# Altium schematic sheet con-top-j4-1.SchDoc: Connector - J4(Top) 1
size Letter; CheckedBy: E. Chiu; CompanyName: Signal Laboratories, Inc.; DrawnBy: J. Brinton; Engineer: J. Brinton; Address1: 3479 Edison Way; Address2: Menlo Park CA 94025; Address3: +1 (877) 778-8435; Address4: siglabs.com; Revision: 1; SheetNumber: 25; SheetTotal: 40
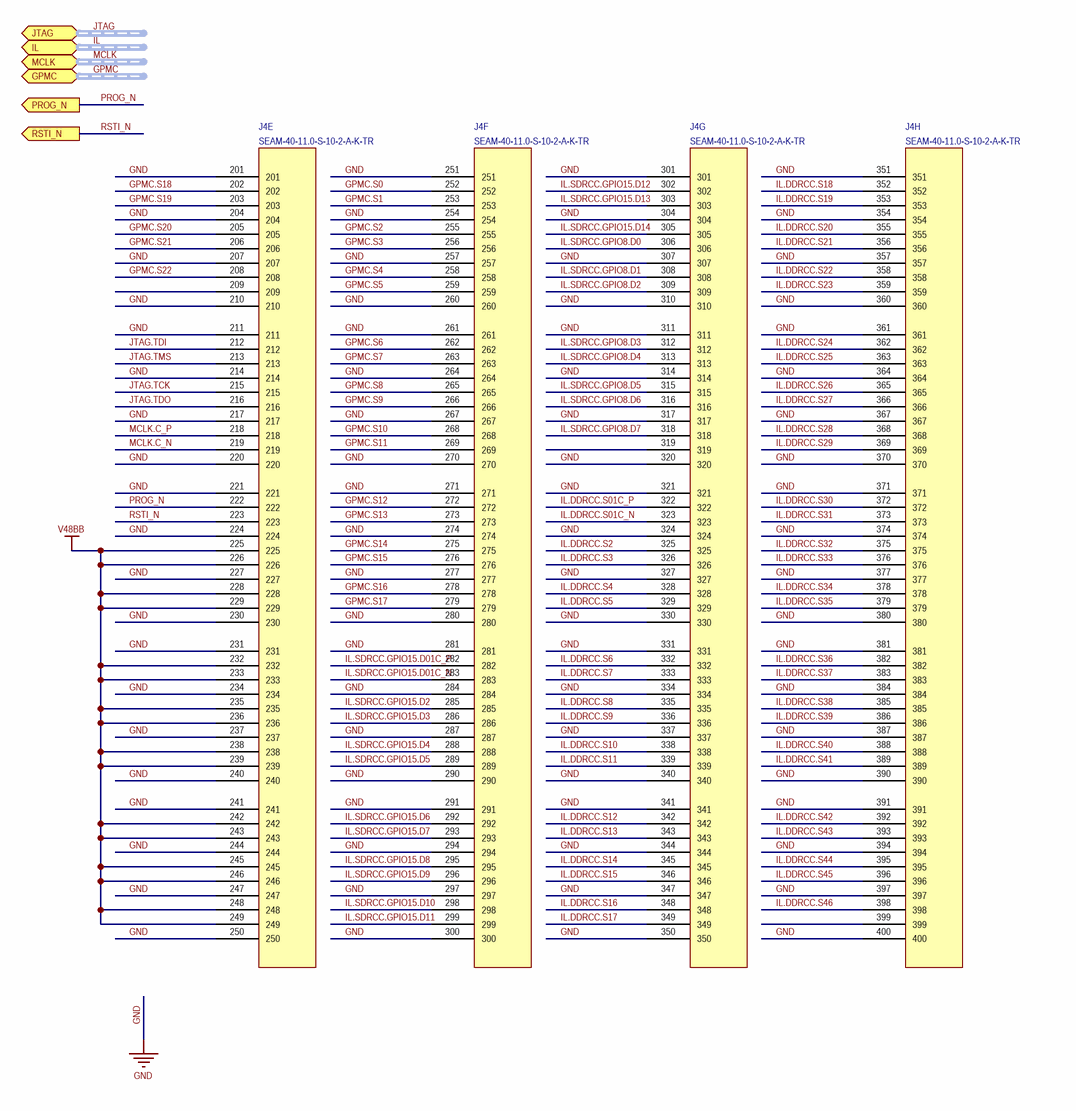
[diagram p0: con-top-j4-1.SchDoc]

## Parts
J4  SEAM-40-11.0-S-10-2-A-K-TR  [SEAM-40-11.0-S-10-2-A-K-TR]  (parts E,F,G,H of 8)

## Ports
GPMC (harness GPMC), IL (harness IL-1V5), JTAG (harness JTAG-1V5), MCLK (harness LVPECL33), PROG_N (out), RSTI_N (out)

## Nets
GND: J4.201 J4.204 J4.207 J4.210 J4.211 J4.214 J4.217 J4.220 J4.221 J4.224 J4.227 J4.230 J4.231 J4.234 J4.237 J4.240 J4.241 J4.244 J4.247 J4.250 J4.251 J4.254 J4.257 J4.260 J4.261 J4.264 J4.267 J4.270 J4.271 J4.274 J4.277 J4.280 J4.281 J4.284 J4.287 J4.290 J4.291 J4.294 J4.297 J4.300 J4.301 J4.304 J4.307 J4.310 J4.311 J4.314 J4.317 J4.320 J4.321 J4.324 J4.327 J4.330 J4.331 J4.334 J4.337 J4.340 J4.341 J4.344 J4.347 J4.350 J4.351 J4.354 J4.357 J4.360 J4.361 J4.364 J4.367 J4.370 J4.371 J4.374 J4.377 J4.380 J4.381 J4.384 J4.387 J4.390 J4.391 J4.394 J4.397 J4.400
V48BB: J4.225 J4.226 J4.228 J4.229 J4.232 J4.233 J4.235 J4.236 J4.238 J4.239 J4.242 J4.243 J4.245 J4.246 J4.248 J4.249
GPMC.S0: J4.252
GPMC.S1: J4.253
GPMC.S2: J4.255
GPMC.S3: J4.256
GPMC.S4: J4.258
GPMC.S5: J4.259
GPMC.S6: J4.262
GPMC.S7: J4.263
GPMC.S8: J4.265
GPMC.S9: J4.266
GPMC.S10: J4.268
GPMC.S11: J4.269
GPMC.S12: J4.272
GPMC.S13: J4.273
GPMC.S14: J4.275
GPMC.S15: J4.276
GPMC.S16: J4.278
GPMC.S17: J4.279
GPMC.S18: J4.202
GPMC.S19: J4.203
GPMC.S20: J4.205
GPMC.S21: J4.206
GPMC.S22: J4.208
IL.DDRCC.S01C_N: J4.323
IL.DDRCC.S01C_P: J4.322
IL.DDRCC.S2: J4.325
IL.DDRCC.S3: J4.326
IL.DDRCC.S4: J4.328
IL.DDRCC.S5: J4.329
IL.DDRCC.S6: J4.332
IL.DDRCC.S7: J4.333
IL.DDRCC.S8: J4.335
IL.DDRCC.S9: J4.336
IL.DDRCC.S10: J4.338
IL.DDRCC.S11: J4.339
IL.DDRCC.S12: J4.342
IL.DDRCC.S13: J4.343
IL.DDRCC.S14: J4.345
IL.DDRCC.S15: J4.346
IL.DDRCC.S16: J4.348
IL.DDRCC.S17: J4.349
IL.DDRCC.S18: J4.352
IL.DDRCC.S19: J4.353
IL.DDRCC.S20: J4.355
IL.DDRCC.S21: J4.356
IL.DDRCC.S22: J4.358
IL.DDRCC.S23: J4.359
IL.DDRCC.S24: J4.362
IL.DDRCC.S25: J4.363
IL.DDRCC.S26: J4.365
IL.DDRCC.S27: J4.366
IL.DDRCC.S28: J4.368
IL.DDRCC.S29: J4.369
IL.DDRCC.S30: J4.372
IL.DDRCC.S31: J4.373
IL.DDRCC.S32: J4.375
IL.DDRCC.S33: J4.376
IL.DDRCC.S34: J4.378
IL.DDRCC.S35: J4.379
IL.DDRCC.S36: J4.382
IL.DDRCC.S37: J4.383
IL.DDRCC.S38: J4.385
IL.DDRCC.S39: J4.386
IL.DDRCC.S40: J4.388
IL.DDRCC.S41: J4.389
IL.DDRCC.S42: J4.392
IL.DDRCC.S43: J4.393
IL.DDRCC.S44: J4.395
IL.DDRCC.S45: J4.396
IL.DDRCC.S46: J4.398
IL.SDRCC.GPIO8.D0: J4.306
IL.SDRCC.GPIO8.D1: J4.308
IL.SDRCC.GPIO8.D2: J4.309
IL.SDRCC.GPIO8.D3: J4.312
IL.SDRCC.GPIO8.D4: J4.313
IL.SDRCC.GPIO8.D5: J4.315
IL.SDRCC.GPIO8.D6: J4.316
IL.SDRCC.GPIO8.D7: J4.318
IL.SDRCC.GPIO15.D01C_N: J4.283
IL.SDRCC.GPIO15.D01C_P: J4.282
IL.SDRCC.GPIO15.D2: J4.285
IL.SDRCC.GPIO15.D3: J4.286
IL.SDRCC.GPIO15.D4: J4.288
IL.SDRCC.GPIO15.D5: J4.289
IL.SDRCC.GPIO15.D6: J4.292
IL.SDRCC.GPIO15.D7: J4.293
IL.SDRCC.GPIO15.D8: J4.295
IL.SDRCC.GPIO15.D9: J4.296
IL.SDRCC.GPIO15.D10: J4.298
IL.SDRCC.GPIO15.D11: J4.299
IL.SDRCC.GPIO15.D12: J4.302
IL.SDRCC.GPIO15.D13: J4.303
IL.SDRCC.GPIO15.D14: J4.305
JTAG.TCK: J4.215
JTAG.TDI: J4.212
JTAG.TDO: J4.216
JTAG.TMS: J4.213
MCLK.C_N: J4.219
MCLK.C_P: J4.218
PROG_N: J4.222 ; port PROG_N
RSTI_N: J4.223 ; port RSTI_N

Not connected (* = marked no-connect by the designer): J4 209 319 399

## Buses and harness runs
harness GPMC = port GPMC
harness IL = port IL
harness JTAG = port JTAG
harness MCLK = port MCLK

## Notes on the sheet
- Title
- Engineer
- Revision
- Drawn By
- Checked By
- Date
- Sheet
- of

## Library data of the parts
J4 = SEAM-40-11.0-S-10-2-A-K-TR: Terminal Array Assembly, Surface Mount, 0.050" Pitch, 400 Pins; Manufacturer: Samtec; Manufacturer P/N: SEAM-40-11.0-S-10-2-A-K-TR